# EAGLE schematic rfidV2 (EAGLE 8.0.1)

## Sheet 1 of 2
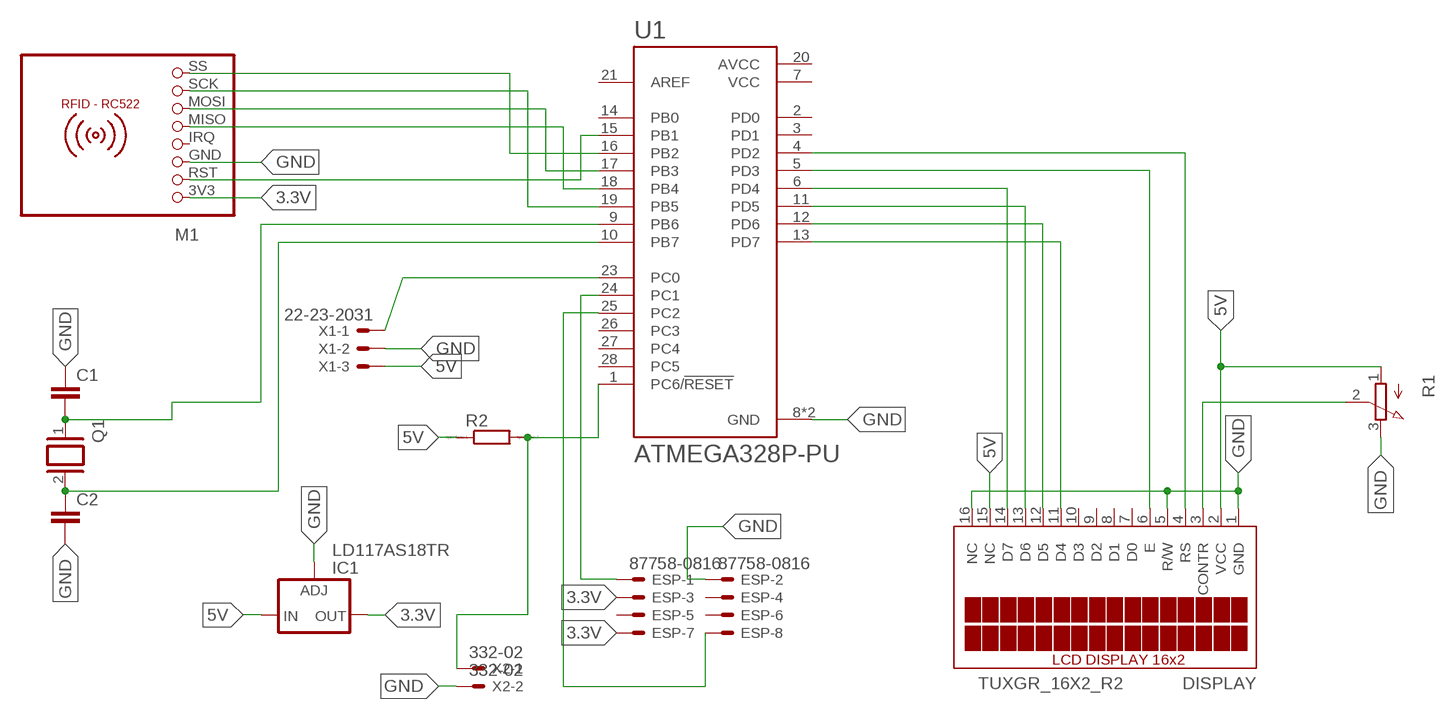
[diagram p0: schematic, sheet 1]

### Parts
C1  C2.5/2  [C2.5-2]
C2  C2.5/2  [C2.5-2]
DISPLAY  TUXGR_16X2_R2  [TUXGR_16X2_R2]
ESP  87758-0816  [87758-0816]
IC1  LD117AS18TR  [SOT223]
M1  RFID-RC522  [RFID-RC522]
Q1  XTAL  [Q]
R1  3RP/1610N  [3RP/1610N]
R2  R0207/10  [0207/10]
U1  ATMEGA328P-PU  [DIP794W46P254L2967H457Q28B]
X1  22-23-2031  [22-23-2031]
X2  332-02  [332-02]

### Nets
3.3V: IC1.4(OUT) M1.3V3
5V: DISPLAY.2(VCC) IC1.3(IN) R1.1(A) R2.1 X1.3
GND: DISPLAY.1(GND) DISPLAY.5(R/W) DISPLAY.16(NC) IC1.1(ADJ) M1.GND R1.3(E) U1.8(GND) U1.22(GND)
N$1: M1.RST U1.15(PB1)
N$2: M1.MISO U1.18(PB4)
N$3: M1.MOSI U1.17(PB3)
N$4: M1.SCK U1.19(PB5)
N$5: M1.SS U1.16(PB2)
N$6: U1.23(PC0) X1.1
N$7: DISPLAY.3(CONTR) R1.2(S)
N$8: DISPLAY.4(RS) U1.4(PD2)
N$9: DISPLAY.6(E) U1.5(PD3)
N$10: DISPLAY.11(D4) U1.13(PD7)
N$11: DISPLAY.12(D5) U1.12(PD6)
N$12: DISPLAY.13(D6) U1.11(PD5)
N$13: DISPLAY.14(D7) U1.6(PD4)
N$14: DISPLAY.15(NC)
N$15: ESP.1 U1.24(PC1)
N$17: ESP.8 U1.25(PC2)
N$18: ESP.2
N$19: C1.2 Q1.1 U1.9(PB6)
N$20: C2.1 Q1.2 U1.10(PB7)
N$21: R2.2 U1.1(PC6/!RESET) X2.1
N$23: X2.2
Unconnected: C1.1 C2.2 DISPLAY.7(D0) DISPLAY.8(D1) DISPLAY.9(D2) DISPLAY.10(D3) ESP.3 ESP.4 ESP.5 ESP.6 ESP.7 M1.IRQ U1.2(PD0) U1.3(PD1) U1.14(PB0) U1.21(AREF) U1.26(PC3) U1.27(PC4) U1.28(PC5) X1.2

## Sheet 2 of 2

## Power pins joined to a net without a drawn wire
AVCC: U1.20(AVCC)
VCC: U1.7(VCC)

## Library data of the parts
C1 C2 = capacitor-wima:C: CAPACITOR naming: grid - package width
DISPLAY = display-lcd:TUXGR_16X2_R2: Tuxgraphics LCD display 16x2 characters reflective, without background light Source: tuxgr_12x2_r2.pdf; OC_FARNELL: unknown; OC_NEWARK: unknown
ESP = con-molex:87758-0816: 8 Pin - 2mm Dual Row Single Wafer, Vertical T/H HDR Source: http://www.molex.com/pdm_docs/sd/877580616_sd.pdf; MF: MOLEX; MPN: 87758-0816; OC_FARNELL: 7472331; OC_NEWARK: 59J1556
IC1 = v-reg:LD117A?*: Low drop fixed and adjustable positive voltage regulators 1 A Source: http://www.st.com/stonline/products/literature/ds/7194/ld1117axx.pdf
M1 = mfrc522-module:RFID-RC522: RFID-RC522 MFRC-522 based breakout board
Q1 = special:XTAL: CRYSTAL
R1 = pot:3RP/1610N: 16mm Potentiometer one level Source: http://www.alphapotentiometers.net/html/16mm_pot_2.html
R2 = eagle-ltspice:R: RESISTOR, European symbol; SPICEMODEL: NONE; SPICEPREFIX: R
U1 = ATMEGA328P-PU:ATMEGA328P-PU: ATmega Series 20 MHz 32 KB Flash 2 KB SRAM 8-Bit Microcontroller - DIP-28; AVAILABILITY: Good; DESCRIPTION: Embedded microcontroller ATMEGA328P-PU PDIP 28 Microchip Technology 8-Bit 20 MHz I/O number 23; MF: Microchip; MP: ATMEGA328P-PU; PACKAGE: PDIP-28 Microchip; PRICE: 2.18 USD
X1 = con-molex:22-23-2031: .100" (2.54mm) Center Header - 3 Pin; MF: MOLEX; MPN: 22-23-2031; OC_FARNELL: 1462950; OC_NEWARK: 30C0862
X2 = con-garry:332-02: 2 Pin - 2mm Dual Row Source: www.mpe-connector.de / garry_shortform_2012.pdf

## Net classes
0 default: width 0.305 mm, drill 0.508 mm, clearance 0.254 mm